# EAGLE schematic FNR Controller v1.2 - Solid state (EAGLE 6.3)
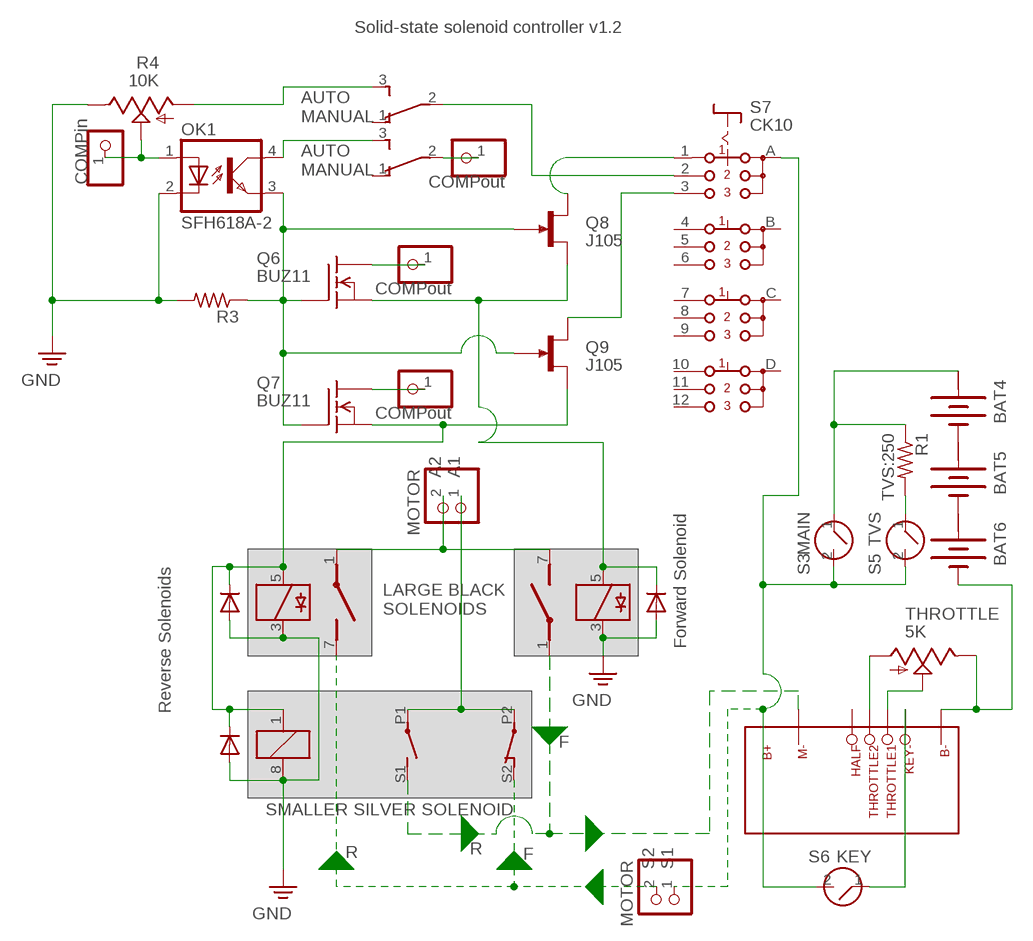
[diagram p0: schematic, sheet 1]

## Parts
BAT4  BATTERY  [BATTERY]
BAT5  BATTERY  [BATTERY]
BAT6  BATTERY  [BATTERY]
D7  1N4004  [DO41-10]
D8  1N4004  [DO41-10]
D9  1N4004  [DO41-10]
JP11  MOTOR  PINHD-1X2  [1X02]
JP13  MOTOR  PINHD-1X2  [1X02]
JP14  COMPout  PINHD-1X1  [1X01]
JP15  COMPout  PINHD-1X1  [1X01]
JP16  COMPin  PINHD-1X1  [1X01]
JP17  COMPout  PINHD-1X1  [1X01]
K8  35701331  [REED]
K9  35701331  [REED]
K10  G6C-2117P  [G6C-2117P]
OK1  SFH618A-2  [DIP4]
Q6  BUZ11  [TO220]
Q7  BUZ11  [TO220]
Q8  J105  [TO92R]
Q9  J105  [TO92R]
R1  TVS:250  R-US_0204/5  [0204/5]
R3  R-US_0204/5  [0204/5]
R4  10K  TRIM_US-CT6  [CT6]
S2  M-A  TL36PO  [TL3XPO]
S3  MAIN  SWITCH  [SWITCH]
S5  TVS  SWITCH  [SWITCH]
S6  KEY  SWITCH  [SWITCH]
S7  CK10  [CK10]
S8  M-A  TL36PO  [TL3XPO]
THROTTLE  5K  TRIM_US-CT6  [CT6]
U$2  MOTOR-CONTROLLER  [MOTOR-CONTROLLER]

## Nets
N$1: OK1.3(EMIT) Q6.1(G) Q7.1(G) Q8.G Q9.G R3.1
N$2: JP16.1 OK1.1(A) R4.S
N$3: D7.C D8.C K8.5 K10.1 Q7.3(S) Q9.S
N$18: JP13.1 S3.2 S5.2 S6.2 S7.A U$2.P$2(B+)
N$19: JP13.2 K8.7(2:S) K10.S2(3:O)
N$20: JP17.1 S2.2(P)
N$21: Q8.D S7.1(A1)
N$22: OK1.4(COL) S2.3(S)
N$24: BAT4.+ R1.1 S3.1
N$25: R1.2 S5.1
N$36: JP11.2 K8.1(2:P) K9.7(2:S)
N$39: JP11.1 K10.P1(2:P) K10.P2(3:P)
N$40: BAT4.- BAT5.+
N$41: BAT5.- BAT6.+
N$43: THROTTLE.S U$2.P$5(THROTTLE1)
N$45: S6.1 U$2.P$4(KEY-)
N$47: K9.1(2:P) K10.S1(2:S) U$2.P$3(M-)
N$49: Q9.D S7.3(A3)
N$50: D9.C K9.5 Q6.3(S) Q8.S
N$51: JP14.1 Q6.2(D)
N$52: JP15.1 Q7.2(D)
N$53: S7.2(A2) S8.2(P)
N$55: R4.A S8.3(S)
N$58: BAT6.- THROTTLE.E U$2.P$1(B-)
N$59: THROTTLE.A U$2.P$6(THROTTLE2)
PE: D7.A D8.A D9.A K8.3 K9.3 K10.8 OK1.2(C) R3.2 R4.E ; supply symbol labelled GND
Unconnected: S2.1(O) S7.4(B1) S7.5(B2) S7.6(B3) S7.7(C1) S7.8(C2) S7.9(C3) S7.10(D1) S7.11(D2) S7.12(D3) S7.B S7.C S7.D S8.1(O) U$2.P$7(HALF)

## Notes on the sheet
- Solid-state solenoid controller v1.2
- AUTO
  MANUAL
- AUTO
  MANUAL
- A2
  A1
- Forward Solenoid
- Reverse Solenoids
- LARGE BLACK
  SOLENOIDS
- F
- SMALLER SILVER SOLENOID
- S2
  S1
- R | R
- F

## Power pins joined to a net without a drawn wire
+: BAT4.+@1(+) BAT5.+@1(+) BAT6.+@1(+)

## Library data of the parts
BAT4-BAT6 = special:BATTERY: BATTERY
D7-D9 = adafruit:1N4004: DIODE General purpose 1N400x type rectifier (With bigger pads) http://www.ladyada.net/library/pcb/eaglelibrary.html
JP11 JP13 = pinhead:PINHD-1X2: PIN HEADER
JP14-JP17 = adafruit:PINHD-1X1: Pin header 1x1 for 0.1" spacing With round pins
K8 K9 = relay:35701331: RELAY reed, 1 x norm. open with polarity; OC_FARNELL: unknown; OC_NEWARK: unknown
K10 = relay:G6C-2117P: RELAY 1 x norm. open, 1x norm. closed, 10 A/240 V, Omron; OC_FARNELL: unknown; OC_NEWARK: unknown
OK1 = optocoupler:SFH618?*: Optocoupler, Phototransistor Output, Low Input Current Source: Data sheet <http://www.vishay.com/docs/83673/sfh618.pdf>; MF: VISHAY/TELEFUNKEN; MPN: SFH618A-2; OC_FARNELL: 6424855; OC_NEWARK: 21H7744
Q6 Q7 = transistor-fet:BUZ11: N-Channel Enhancement MOSFET 50V; 30A; 0,040Ohm
Q8 Q9 = transistor-small-signal:J105: N-CHANNEL FET J105, J106, J107 Source: http://www.fairchildsemi.com/pf/J1/J105.html
R1 R3 = rcl:R-US_: RESISTOR, American symbol
R4 THROTTLE = pot:TRIM_US-: POTENTIOMETER
S2 S8 = switch:TL36PO: TINY SWITCH ON - ON Source: http://www2.produktinfo.conrad.com/datenblaetter/700000-724999/705152-da-01-de-Subminiaturschalter_TL_36YO.pdf
S3 S5 S6 = custom:SWITCH: Push button switch
S7 = switch:CK10: ROTARY SWITCH C&K
U$2 = custom:MOTOR-CONTROLLER